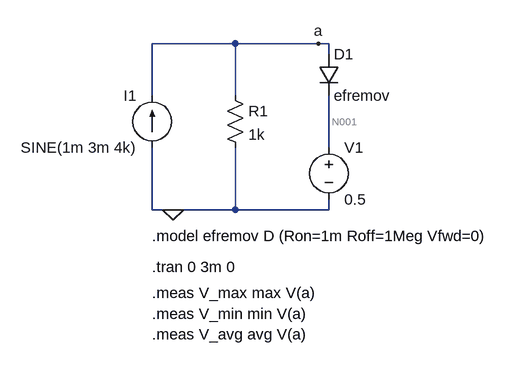
[diagram p0: schematic task_2c.asc]
task_2c.asc, the LTspice schematic file:
Version 4
SHEET 1 880 680
WIRE 192 96 64 96
WIRE 320 96 192 96
WIRE 336 96 320 96
WIRE 336 112 336 96
WIRE 64 176 64 96
WIRE 192 176 192 96
WIRE 336 256 336 176
WIRE 64 352 64 256
WIRE 96 352 64 352
WIRE 192 352 192 256
WIRE 192 352 96 352
WIRE 336 352 336 336
WIRE 336 352 192 352
FLAG 96 352 0
FLAG 320 96 a
SYMBOL current 64 256 R180
WINDOW 0 24 80 Left 2
WINDOW 3 24 0 Left 2
WINDOW 123 24 -28 Left 2
WINDOW 39 0 0 Left 0
SYMATTR InstName I1
SYMATTR Value SINE(1m 3m 4k)
SYMBOL res 176 160 R0
SYMATTR InstName R1
SYMATTR Value 1k
SYMBOL diode 320 112 R0
SYMATTR InstName D1
SYMATTR Value efremov
SYMBOL voltage 336 240 R0
WINDOW 123 24 124 Left 2
WINDOW 39 0 0 Left 0
SYMATTR InstName V1
SYMATTR Value 0.5
TEXT 64 440 Left 2 !.tran 0 3m 0
TEXT 64 392 Left 2 !.model efremov D (Ron=1m Roff=1Meg Vfwd=0)
TEXT 64 480 Left 2 !.meas V_max max V(a)
TEXT 64 512 Left 2 !.meas V_min min V(a)
TEXT 64 544 Left 2 !.meas V_avg avg V(a)

The netlist it stands for:
* task_2c.asc
I1 0 a SINE(1m 3m 4k)
R1 a 0 1k
D1 a N001 efremov
V1 N001 0 0.5
.model D D
.lib standard.dio
.tran 0 3m 0
.model efremov D (Ron=1m Roff=1Meg Vfwd=0)
.meas V_max max V(a)
.meas V_min min V(a)
.meas V_avg avg V(a)
.backanno
.end

* Results of the author's LTspice run, read from the files saved beside the schematic
* Operating Point, zero values left out:
*   V(a) = 500 mV
*   V(n001) = 500 mV
*   I(D1) = 500 µA
*   I(I1) = 1 mA
*   I(R1) = 500 µA
*   I(V1) = 500 µA
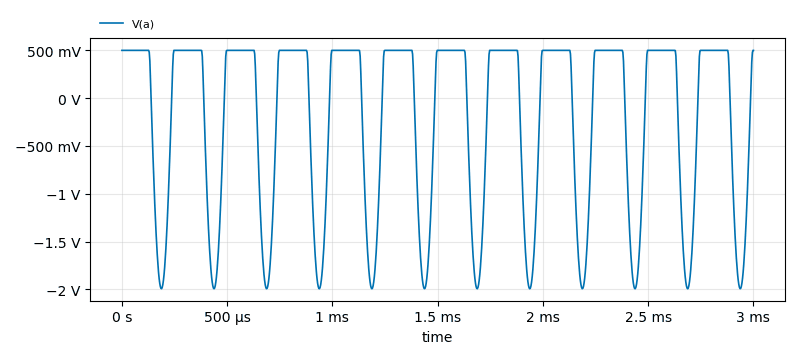
[diagram p1: Transient Analysis of task_2c.asc, plotted from the saved traces]
* Transient Analysis, 1 run:
*   V(a): min -1.993 V, max 500 mV, average -217.5 mV, rms 969.9 mV, last 500 mV
* From the log:
*   v_max: MAX(v(a))=0.500004 FROM 0 TO 0.003
*   v_min: MIN(v(a))=-1.99344 FROM 0 TO 0.003
*   v_avg: AVG(v(a))=-0.217498 FROM 0 TO 0.003